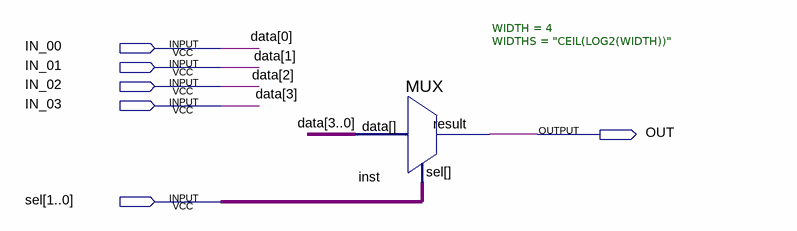
[diagram p0: schematic sheet]
// Quartus schematic mux4x1.bdf as structural Verilog: 1 symbols, 6 pins
module mux4x1 (
  input  IN_00,
  input  IN_01,
  input  IN_02,
  input  IN_03,
  input  [1:0] sel,
  output OUT
);

  MUX #(.WIDTH(4), .WIDTHS("CEIL(LOG2(WIDTH))")) inst (.data({IN_03, IN_02, IN_01, IN_00}), .sel(sel), .result(OUT));

  // Other names for the same wires on the sheet: data[3:0] = {IN_03, IN_02, IN_01, IN_00}
endmodule
